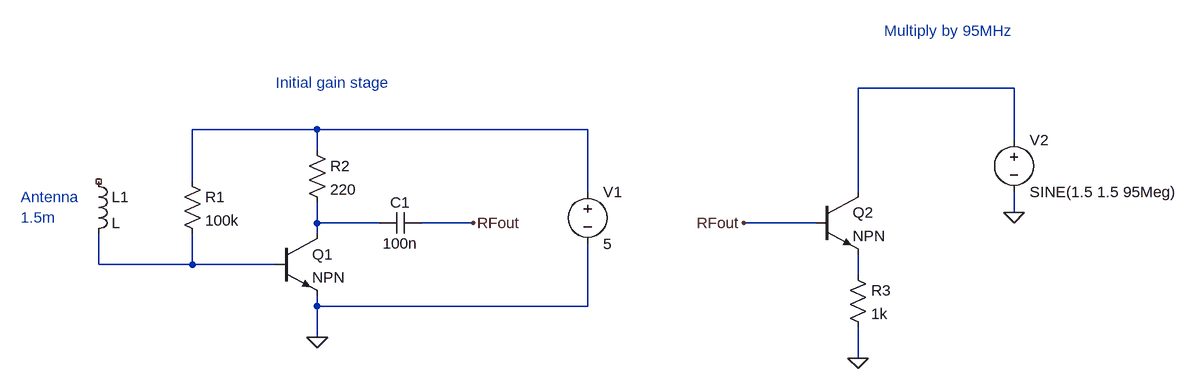
[diagram p0: schematic radio receiver.asc]
radio receiver.asc, the LTspice schematic file:
Version 4
SHEET 1 1756 680
WIRE 1488 -48 1248 -48
WIRE 416 16 224 16
WIRE 832 16 416 16
WIRE 1488 32 1488 -48
WIRE 416 48 416 16
WIRE 224 96 224 16
WIRE 832 112 832 16
WIRE 1248 112 1248 -48
WIRE 1488 144 1488 112
WIRE 416 160 416 128
WIRE 512 160 416 160
WIRE 656 160 576 160
WIRE 1184 160 1072 160
WIRE 416 176 416 160
WIRE 80 224 80 176
WIRE 224 224 224 176
WIRE 224 224 80 224
WIRE 352 224 224 224
WIRE 1248 240 1248 208
WIRE 416 288 416 272
WIRE 832 288 832 192
WIRE 832 288 416 288
WIRE 416 336 416 288
WIRE 1248 368 1248 320
FLAG 416 336 0
FLAG 656 160 RFout
FLAG 1248 368 0
FLAG 1488 144 0
FLAG 1072 160 RFout
SYMBOL ind 64 80 R0
SYMATTR InstName L1
SYMBOL res 208 80 R0
SYMATTR InstName R1
SYMATTR Value 100k
SYMBOL npn 352 176 R0
SYMATTR InstName Q1
SYMBOL res 400 32 R0
SYMATTR InstName R2
SYMATTR Value 220
SYMBOL cap 576 144 R90
WINDOW 0 0 32 VBottom 2
WINDOW 3 32 32 VTop 2
SYMATTR InstName C1
SYMATTR Value 100n
SYMBOL voltage 832 96 R0
WINDOW 123 0 0 Left 0
WINDOW 39 0 0 Left 0
SYMATTR InstName V1
SYMATTR Value 5
SYMBOL npn 1184 112 R0
SYMATTR InstName Q2
SYMBOL res 1232 224 R0
SYMATTR InstName R3
SYMATTR Value 1k
SYMBOL voltage 1488 16 R0
WINDOW 123 0 0 Left 0
WINDOW 39 0 0 Left 0
SYMATTR InstName V2
SYMATTR Value SINE(1.5 1.5 95Meg)
TEXT -40 120 Left 2 ;Antenna\n1.5m
TEXT 352 -56 Left 2 ;Initial gain stage
TEXT 1288 -136 Left 2 ;Multiply by 95MHz

The netlist it stands for:
* radio receiver.asc
L1 NC_01 N004 L
R1 N002 N004 100k
Q1 N003 N004 0 0 NPN
R2 N002 N003 220
C1 RFout N003 100n
V1 N002 0 5
Q2 N001 RFout N005 0 NPN
R3 N005 0 1k
V2 N001 0 SINE(1.5 1.5 95Meg)
.model NPN NPN
.model PNP PNP
.lib standard.bjt
* Antenna
* 1.5m
* Initial gain stage
* Multiply by 95MHz
.backanno
.end